# Altium schematic sheet MCU.SchDoc
size A3
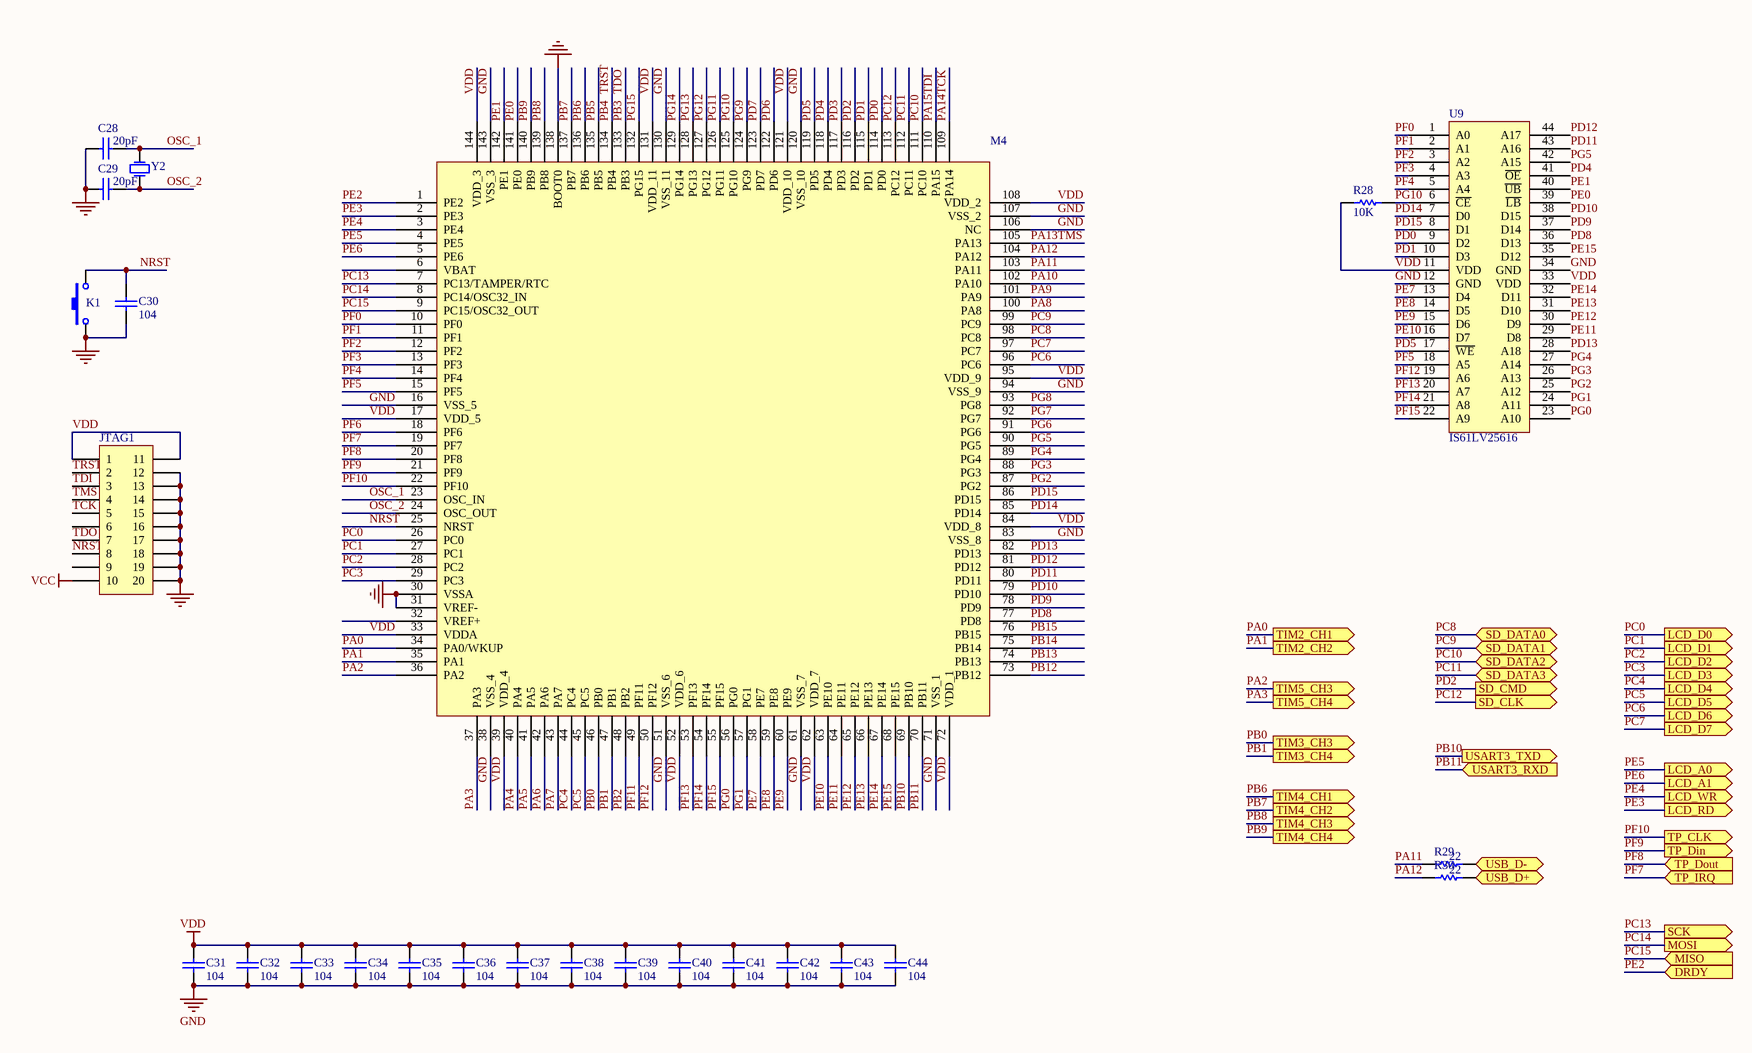
[diagram p0: MCU.SchDoc]

## Parts
C28  value 20pF  [CR2012-0805]  (hidden comment: Cap)
C29  value 20pF  [CR2012-0805]  (hidden comment: Cap)
C30  value 104  [CR2012-0805]  (hidden comment: Cap)
C31  value 104  [CR2012-0805]  (hidden comment: Cap)
C32  value 104  [CR2012-0805]  (hidden comment: Cap)
C33  value 104  [CR2012-0805]  (hidden comment: Cap)
C34  value 104  [CR2012-0805]  (hidden comment: Cap)
C35  value 104  [CR2012-0805]  (hidden comment: Cap)
C36  value 104  [CR2012-0805]  (hidden comment: Cap)
C37  value 104  [CR2012-0805]  (hidden comment: Cap)
C38  value 104  [CR2012-0805]  (hidden comment: Cap)
C39  value 104  [CR2012-0805]  (hidden comment: Cap)
C40  value 104  [CR2012-0805]  (hidden comment: Cap)
C41  value 104  [CR2012-0805]  (hidden comment: Cap)
C42  value 104  [CR2012-0805]  (hidden comment: Cap)
C43  value 104  [CR2012-0805]  (hidden comment: Cap)
C44  value 104  [CR2012-0805]  (hidden comment: Cap)
JTAG1  (no value)  [HDR2X10_CEN]
K1  SW-PB  [SW-PB-6.5x4.5]  (value not drawn)
M4  STM32  [F-QFP20x20-G144/N]  (value not drawn)
R28  value 10K  [CR2012-0805]  (hidden comment: Res)
R29  value 22  [CR2012-0805]  (hidden comment: Res)
R30  value 22  [CR2012-0805]  (hidden comment: Res)
U9  IS61LV25616  [SO-G44/P.8]
Y2  XTAL  [XTAL]  (value not drawn)

## Ports
DRDY (in), LCD_A0 (out), LCD_A1 (out), LCD_D0 (out), LCD_D1 (out), LCD_D2 (out), LCD_D3 (out), LCD_D4 (out), LCD_D5 (out), LCD_D6 (out), LCD_D7 (out), LCD_RD (out), LCD_WR (out), MISO (in), MOSI (out), SCK (out), SD_CLK (out), SD_CMD (out), SD_DATA0 (bidir), SD_DATA1 (bidir), SD_DATA2 (bidir), SD_DATA3 (bidir), TIM2_CH1 (out), TIM2_CH2 (out), TIM3_CH3 (out), TIM3_CH4 (out), TIM4_CH1 (out), TIM4_CH2 (out), TIM4_CH3 (out), TIM4_CH4 (out), TIM5_CH3 (out), TIM5_CH4 (out), TP_CLK (out), TP_Din (out), TP_Dout (in), TP_IRQ (in), USART3_RXD (in), USART3_TXD (out), USB_D+ (bidir), USB_D- (bidir)

## Nets
GND: C28.1 C29.1 C30.1 C31.1 C32.1 C33.1 C34.1 C35.1 C36.1 C37.1 C38.1 C39.1 C40.1 C41.1 C42.1 C43.1 C44.1 JTAG1.12 JTAG1.13 JTAG1.14 JTAG1.15 JTAG1.16 JTAG1.17 JTAG1.18 JTAG1.19 JTAG1.20 K1.1 M4.16(VSS_5) M4.30(VSSA) M4.31(VREF-) M4.38(VSS_4) M4.51(VSS_6) M4.61(VSS_7) M4.71(VSS_1) M4.83(VSS_8) M4.94(VSS_9) M4.106(NC) M4.107(VSS_2) M4.120(VSS_10) M4.130(VSS_11) M4.138(BOOT0) M4.143(VSS_3) U9.12(GND) U9.34(GND)
VCC: JTAG1.10
VDD: C31.2 C32.2 C33.2 C34.2 C35.2 C36.2 C37.2 C38.2 C39.2 C40.2 C41.2 C42.2 C43.2 C44.2 JTAG1.1 JTAG1.11 M4.17(VDD_5) M4.33(VDDA) M4.39(VDD_4) M4.52(VDD_6) M4.62(VDD_7) M4.72(VDD_1) M4.84(VDD_8) M4.95(VDD_9) M4.108(VDD_2) M4.121(VDD_10) M4.131(VDD_11) M4.144(VDD_3) R28.1 U9.11(VDD) U9.33(VDD)
NRST: C30.2 JTAG1.8 K1.2 M4.25(NRST)
OSC_1: C28.2 M4.23(OSC_IN) Y2.2(OSC2)
OSC_2: C29.2 M4.24(OSC_OUT) Y2.1(OSC1)
PA0: M4.34(PA0/WKUP) ; port TIM2_CH1
PA1: M4.35(PA1) ; port TIM2_CH2
PA2: M4.36(PA2) ; port TIM5_CH3
PA3: M4.37(PA3) ; port TIM5_CH4
PA4: M4.40(PA4)
PA5: M4.41(PA5)
PA6: M4.42(PA6)
PA7: M4.43(PA7)
PA8: M4.100(PA8)
PA9: M4.101(PA9)
PA10: M4.102(PA10)
PA11: M4.103(PA11) R29.1
PA12: M4.104(PA12) R30.1
PA13: JTAG1.4 M4.105(PA13)  [also labelled TMS]
PA14: JTAG1.5 M4.109(PA14)  [also labelled TCK]
PA15: JTAG1.3 M4.110(PA15)  [also labelled TDI]
PB0: M4.46(PB0) ; port TIM3_CH3
PB1: M4.47(PB1) ; port TIM3_CH4
PB2: M4.48(PB2)
PB3: JTAG1.7 M4.133(PB3)  [also labelled TDO]
PB4: JTAG1.2 M4.134(PB4)  [also labelled TRST]
PB5: M4.135(PB5)
PB6: M4.136(PB6) ; port TIM4_CH1
PB7: M4.137(PB7) ; port TIM4_CH2
PB8: M4.139(PB8) ; port TIM4_CH3
PB9: M4.140(PB9) ; port TIM4_CH4
PB10: M4.69(PB10) ; port USART3_TXD
PB11: M4.70(PB11) ; port USART3_RXD
PB12: M4.73(PB12)
PB13: M4.74(PB13)
PB14: M4.75(PB14)
PB15: M4.76(PB15)
PC0: M4.26(PC0) ; port LCD_D0
PC1: M4.27(PC1) ; port LCD_D1
PC2: M4.28(PC2) ; port LCD_D2
PC3: M4.29(PC3) ; port LCD_D3
PC4: M4.44(PC4) ; port LCD_D4
PC5: M4.45(PC5) ; port LCD_D5
PC6: M4.96(PC6) ; port LCD_D6
PC7: M4.97(PC7) ; port LCD_D7
PC8: M4.98(PC8) ; port SD_DATA0
PC9: M4.99(PC9) ; port SD_DATA1
PC10: M4.111(PC10) ; port SD_DATA2
PC11: M4.112(PC11) ; port SD_DATA3
PC12: M4.113(PC12) ; port SD_CLK
PC13: M4.7(PC13/TAMPER/RTC) ; port SCK
PC14: M4.8(PC14/OSC32_IN) ; port MOSI
PC15: M4.9(PC15/OSC32_OUT) ; port MISO
PD0: M4.114(PD0) U9.9(D2)
PD1: M4.115(PD1) U9.10(D3)
PD2: M4.116(PD2) ; port SD_CMD
PD3: M4.117(PD3)
PD4: M4.118(PD4) U9.41(~{OE})
PD5: M4.119(PD5) U9.17(~{WE})
PD6: M4.122(PD6)
PD7: M4.123(PD7)
PD8: M4.77(PD8) U9.36(D13)
PD9: M4.78(PD9) U9.37(D14)
PD10: M4.79(PD10) U9.38(D15)
PD11: M4.80(PD11) U9.43(A16)
PD12: M4.81(PD12) U9.44(A17)
PD13: M4.82(PD13) U9.28(A18)
PD14: M4.85(PD14) U9.7(D0)
PD15: M4.86(PD15) U9.8(D1)
PE0: M4.141(PE0) U9.39(~{LB})
PE1: M4.142(PE1) U9.40(~{UB})
PE2: M4.1(PE2) ; port DRDY
PE3: M4.2(PE3) ; port LCD_RD
PE4: M4.3(PE4) ; port LCD_WR
PE5: M4.4(PE5) ; port LCD_A0
PE6: M4.5(PE6) ; port LCD_A1
PE7: M4.58(PE7) U9.13(D4)
PE8: M4.59(PE8) U9.14(D5)
PE9: M4.60(PE9) U9.15(D6)
PE10: M4.63(PE10) U9.16(D7)
PE11: M4.64(PE11) U9.29(D8)
PE12: M4.65(PE12) U9.30(D9)
PE13: M4.66(PE13) U9.31(D10)
PE14: M4.67(PE14) U9.32(D11)
PE15: M4.68(PE15) U9.35(D12)
PF0: M4.10(PF0) U9.1(A0)
PF1: M4.11(PF1) U9.2(A1)
PF2: M4.12(PF2) U9.3(A2)
PF3: M4.13(PF3) U9.4(A3)
PF4: M4.14(PF4) U9.5(A4)
PF5: M4.15(PF5) U9.18(A5)
PF6: M4.18(PF6)
PF7: M4.19(PF7) ; port TP_IRQ
PF8: M4.20(PF8) ; port TP_Dout
PF9: M4.21(PF9) ; port TP_Din
PF10: M4.22(PF10) ; port TP_CLK
PF11: M4.49(PF11)
PF12: M4.50(PF12) U9.19(A6)
PF13: M4.53(PF13) U9.20(A7)
PF14: M4.54(PF14) U9.21(A8)
PF15: M4.55(PF15) U9.22(A9)
PG0: M4.56(PG0) U9.23(A10)
PG1: M4.57(PG1) U9.24(A11)
PG2: M4.87(PG2) U9.25(A12)
PG3: M4.88(PG3) U9.26(A13)
PG4: M4.89(PG4) U9.27(A14)
PG5: M4.90(PG5) U9.42(A15)
PG6: M4.91(PG6)
PG7: M4.92(PG7)
PG8: M4.93(PG8)
PG9: M4.124(PG9)
PG10: M4.125(PG10) R28.2 U9.6(~{CE})
PG11: M4.126(PG11)
PG12: M4.127(PG12)
PG13: M4.128(PG13)
PG14: M4.129(PG14)
PG15: M4.132(PG15)
USB_D+: R30.2 ; port USB_D+
USB_D-: R29.2 ; port USB_D-

Not connected (* = marked no-connect by the designer): JTAG1 6 9; M4 6(VBAT) 32(VREF+)

## Library data of the parts
C28-C44 = Cap: Capacitor; Published: 8-Jun-2000; LatestRevisionDate: 17-Jul-2002; LatestRevisionNote: Re-released for DXP Platform.; Publisher: Altium Limited
JTAG1 = Header 10X2A: Header, 10-Pin, Dual row; LatestRevisionDate: 17-Jul-2002; LatestRevisionNote: Re-released for DXP Platform.; Publisher: Altium Limited
K1 = SW-PB: Switch; Published: 24-Mar-1999; LatestRevisionDate: 17-Jul-2002; LatestRevisionNote: Re-released for DXP Platform.; Publisher: Altium Limited
M4 = STM32_104
R28-R30 = Res: Resistor; Published: 8-Jun-2000; LatestRevisionDate: 17-Jul-2002; LatestRevisionNote: Re-released for DXP Platform.; Publisher: Altium Limited
U9 = IS61LV25616: 64K*16 SRAM
Y2 = XTAL: Crystal Oscillator; Published: 8-Jun-2000; LatestRevisionDate: 17-Jul-2002; LatestRevisionNote: Re-released for DXP Platform.; Publisher: Altium Limited